# EAGLE design UI_measurement (EAGLE 9.4.0)
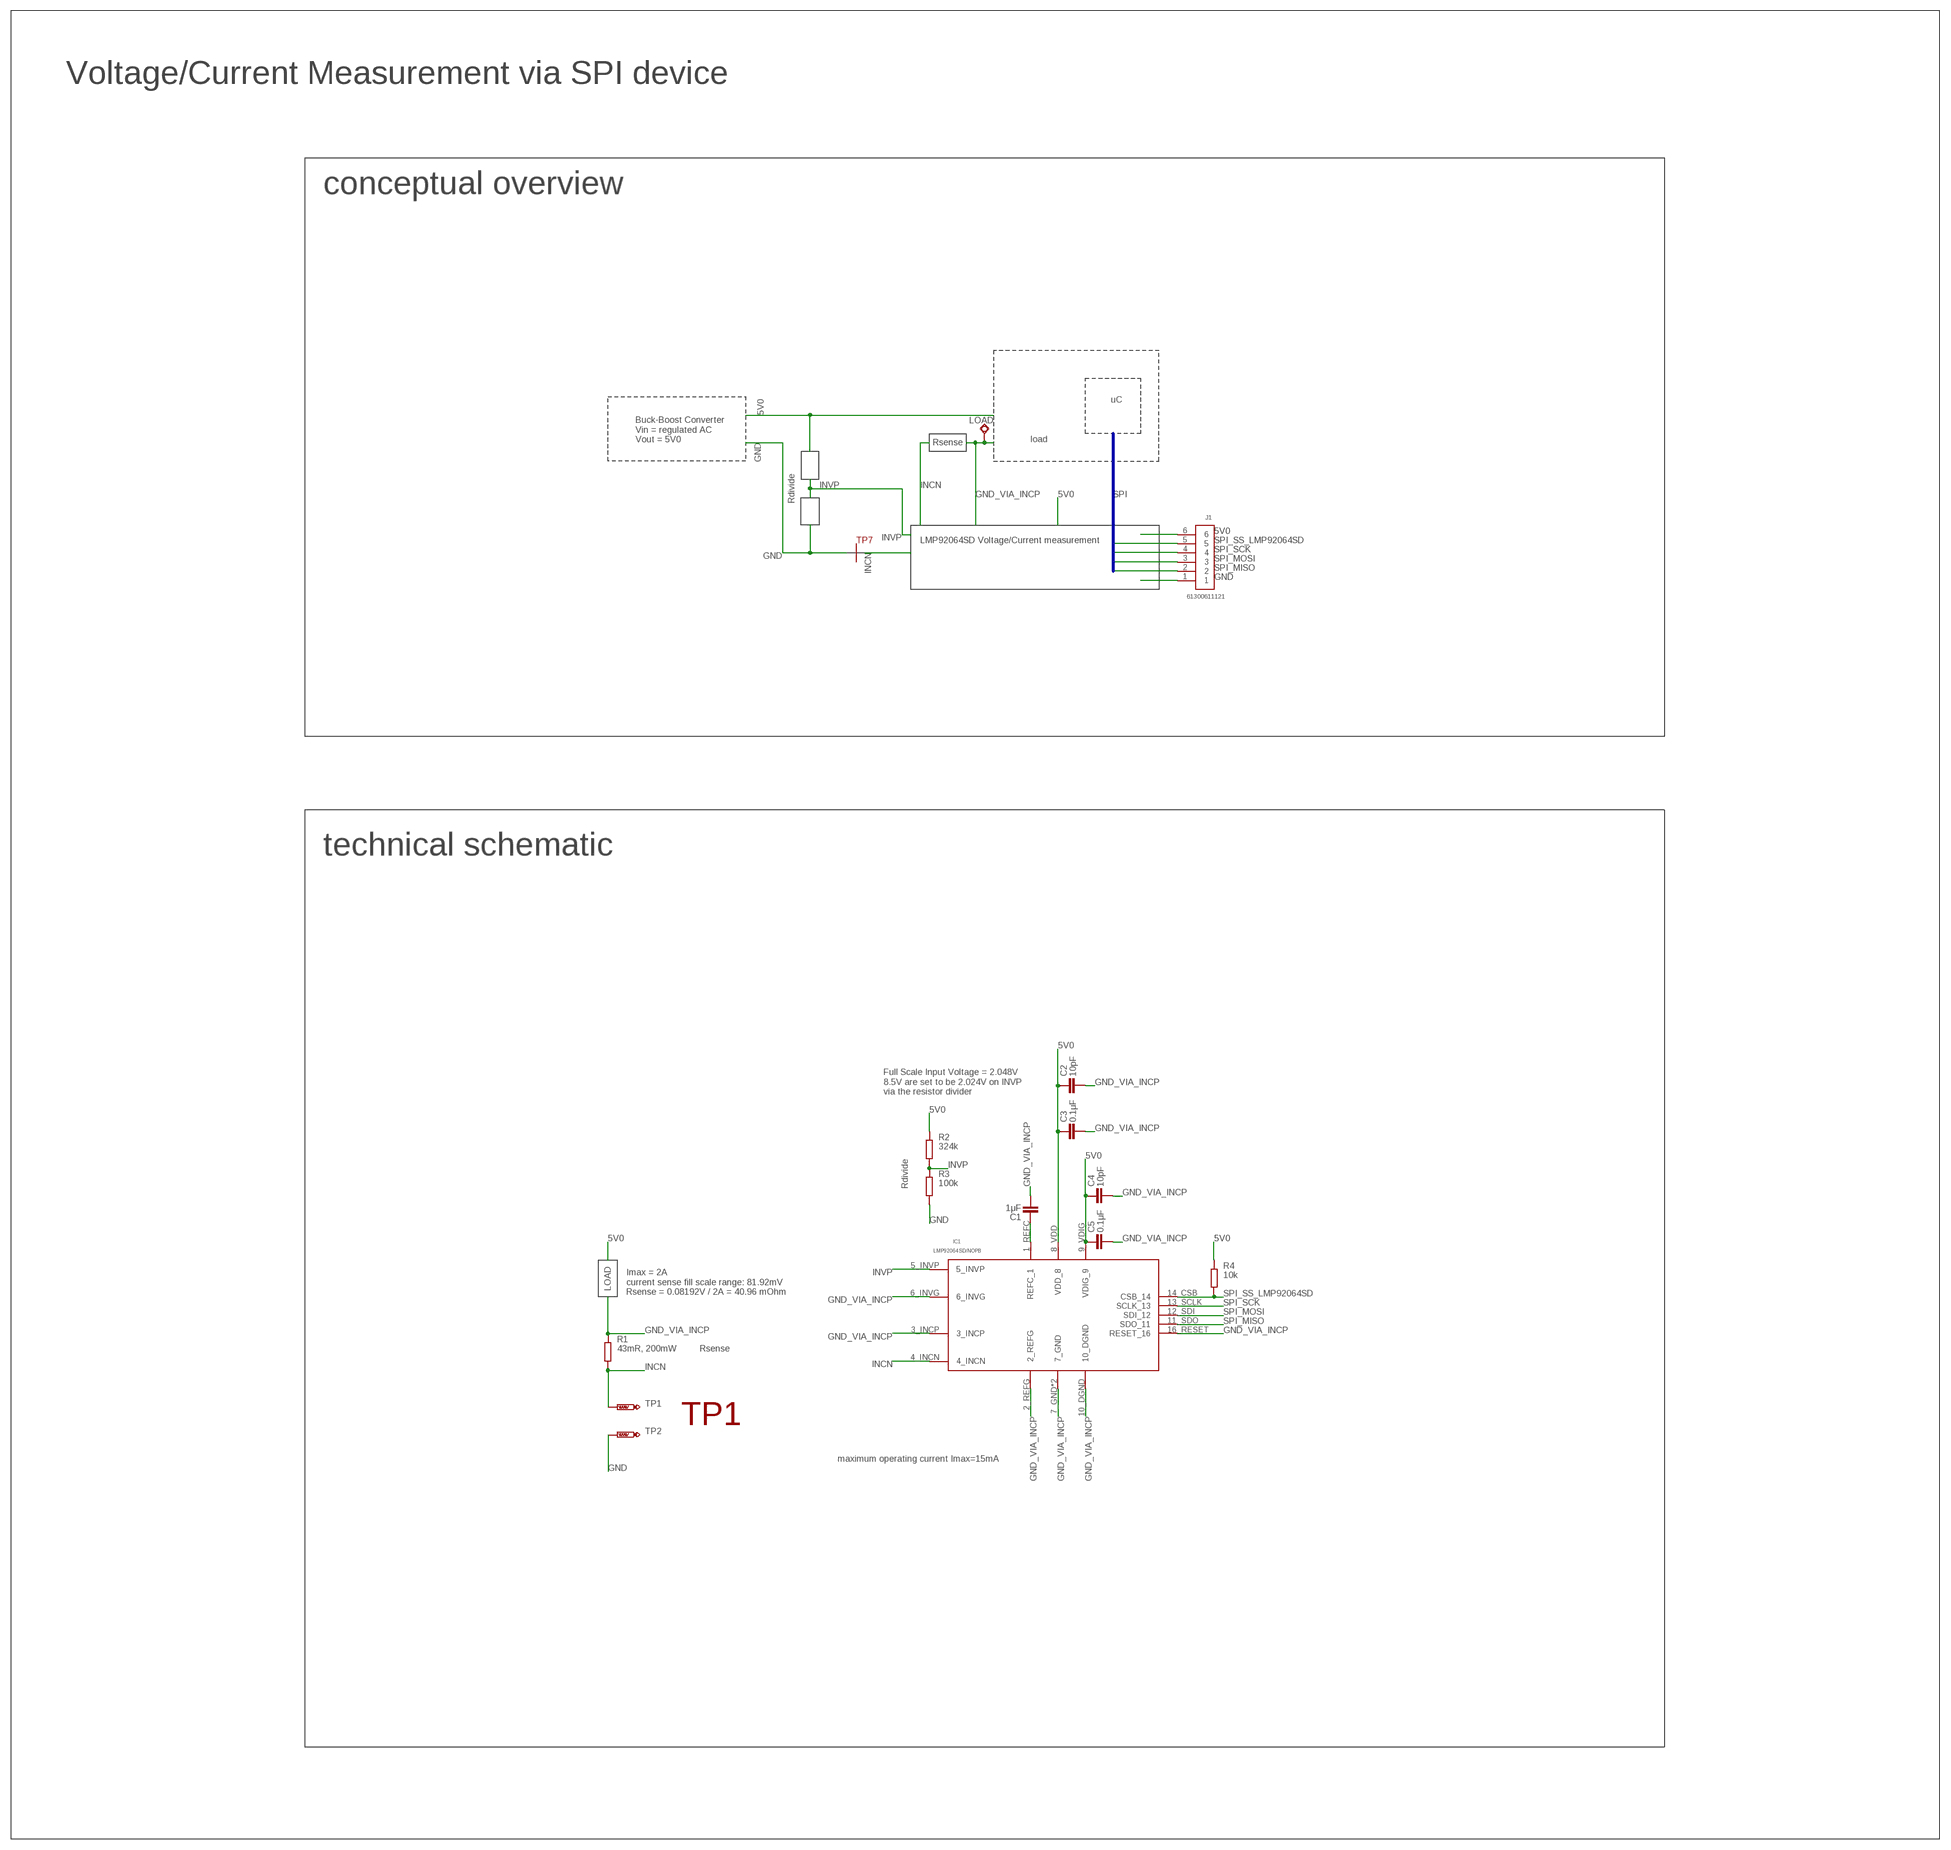
[diagram p0: schematic, sheet 1]

## Parts
C1  1μF  C-EUC0402  [C0402]
C2  10pF  C-EUC0402  [C0402]
C3  0.1μF  C-EUC0402  [C0402]
C4  10pF  C-EUC0402  [C0402]
C5  0.1μF  C-EUC0402  [C0402]
IC1  LMP92064SD/NOPB  LMP92064SD  [WSON-16]
J1  61300611121  [61300611121]
LOAD  TPSQPAD1-13  [P1-13]
R1  43mR, 200mW  R-EU_R2512  [R2512]
R2  324k  R-EU_R0402  [R0402]
R3  100k  R-EU_R0402  [R0402]
R4  10k  R-EU_R0402  [R0402]
TP1  PTR1TP10SQ  [TP10SQ]
TP2  PTR1TP10SQ  [TP10SQ]

## Nets
5V0 [5V0]: C2.1 C3.1 C4.1 C5.1 IC1.8_VDD(VDD_8) IC1.9_VDIG(VDIG_9) J1.6 R2.2 R4.2
GND: J1.1 R3.1 TP2.TP
GND_VIA_INCP [GND_VIA_INCP]: C1.2 C2.2 C3.2 C4.2 C5.2 IC1.2_REFG IC1.3_INCP IC1.6_INVG IC1.7_GND IC1.10_DGND IC1.16_RESET(RESET_16) IC1.GND1(7_GND) LOAD.TP R1.2
INCN [GND_VIA_INCP]: IC1.4_INCN R1.1 TP1.TP
INVP [signal]: IC1.5_INVP R2.1 R3.2
N$17 [signal]: C1.1 IC1.1_REFC(REFC_1)
SPI_MISO [signal]: IC1.11_SDO(SDO_11) J1.2
SPI_MOSI [signal]: IC1.12_SDI(SDI_12) J1.3
SPI_SCK [signal]: IC1.13_SCLK(SCLK_13) J1.4
SPI_SS_LMP92064SD [signal]: IC1.14_CSB(CSB_14) J1.5 R4.1

## Buses
SPI_MISO,SPI_MOSI,SPI_SCK,SPI_SS_LMP92064SD

## Notes on the sheet
- Voltage/Current Measurement via SPI device
- conceptual overview
- uC
- Buck-Boost Converter
  Vin = regulated AC
  Vout = 5V0
- Rsense | load
- Rdivide
- SPI
- TP7 | LMP92064SD Voltage/Current measurement
- technical schematic
- Full Scale Input Voltage = 2.048V
  8.5V are set to be 2.024V on INVP
  via the resistor divider
- Rdivide
- Imax = 2A
  current sense fill scale range: 81.92mV
  Rsense = 0.08192V / 2A = 40.96 mOhm
- LOAD
- Rsense
- TP1
- maximum operating current Imax=15mA

## Library data of the parts
C1-C5 = rcl:C-EU: CAPACITOR, European symbol; SPICEPREFIX: C
IC1 = LMP92064SD - LMP92064 Precision Low-Side, 125-kSps Simultaneous Sampling Current Sensor and Voltage Monitor With SPI:LMP92064SD
J1 = Headers:61300611121: CONN HEADER VERT 6POS 2.54MM Manufacturer's datasheet <https://katalog.we-online.de/em/datasheet/6130xx11121.pdf>; CREATED_BY: PCBLayout.com; DIGI_KEY_PART_NUMBER: 732-5319-ND; MANUFACTURER: Wurth Electronics Inc.; MPN: 61300611121
LOAD = testpad:TPSQ: Test pad
R1-R4 = rcl:R-EU_: RESISTOR, European symbol; SPICEPREFIX: R
TP1 TP2 = testpad:PTR1: TEST PIN

## Net classes
0 GND: width 0.5 mm, drill 0.3 mm, clearance 0.2 mm
1 GND_VIA_INCP: width 0.5 mm, drill 0.3 mm, clearance 0.2 mm
2 5V0: width 0.3 mm, drill 0.3 mm, clearance 0.2 mm
3 signal: width 0.25 mm, drill 0.3 mm, clearance 0.2 mm

## Board
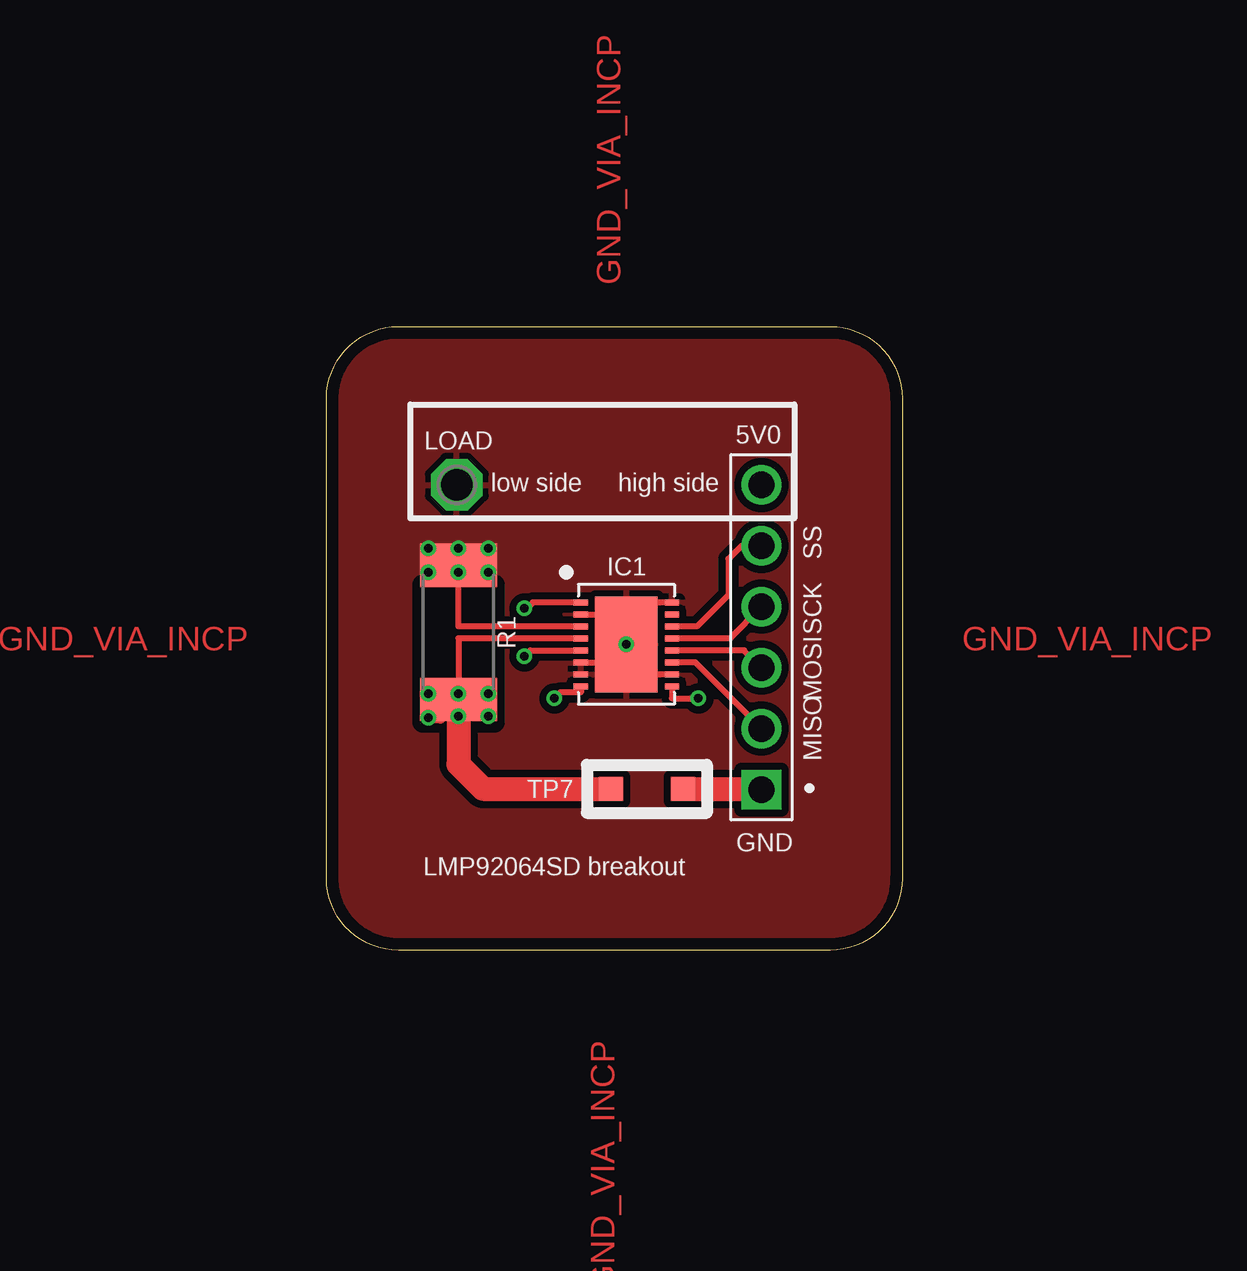
[diagram p1: board, top side]
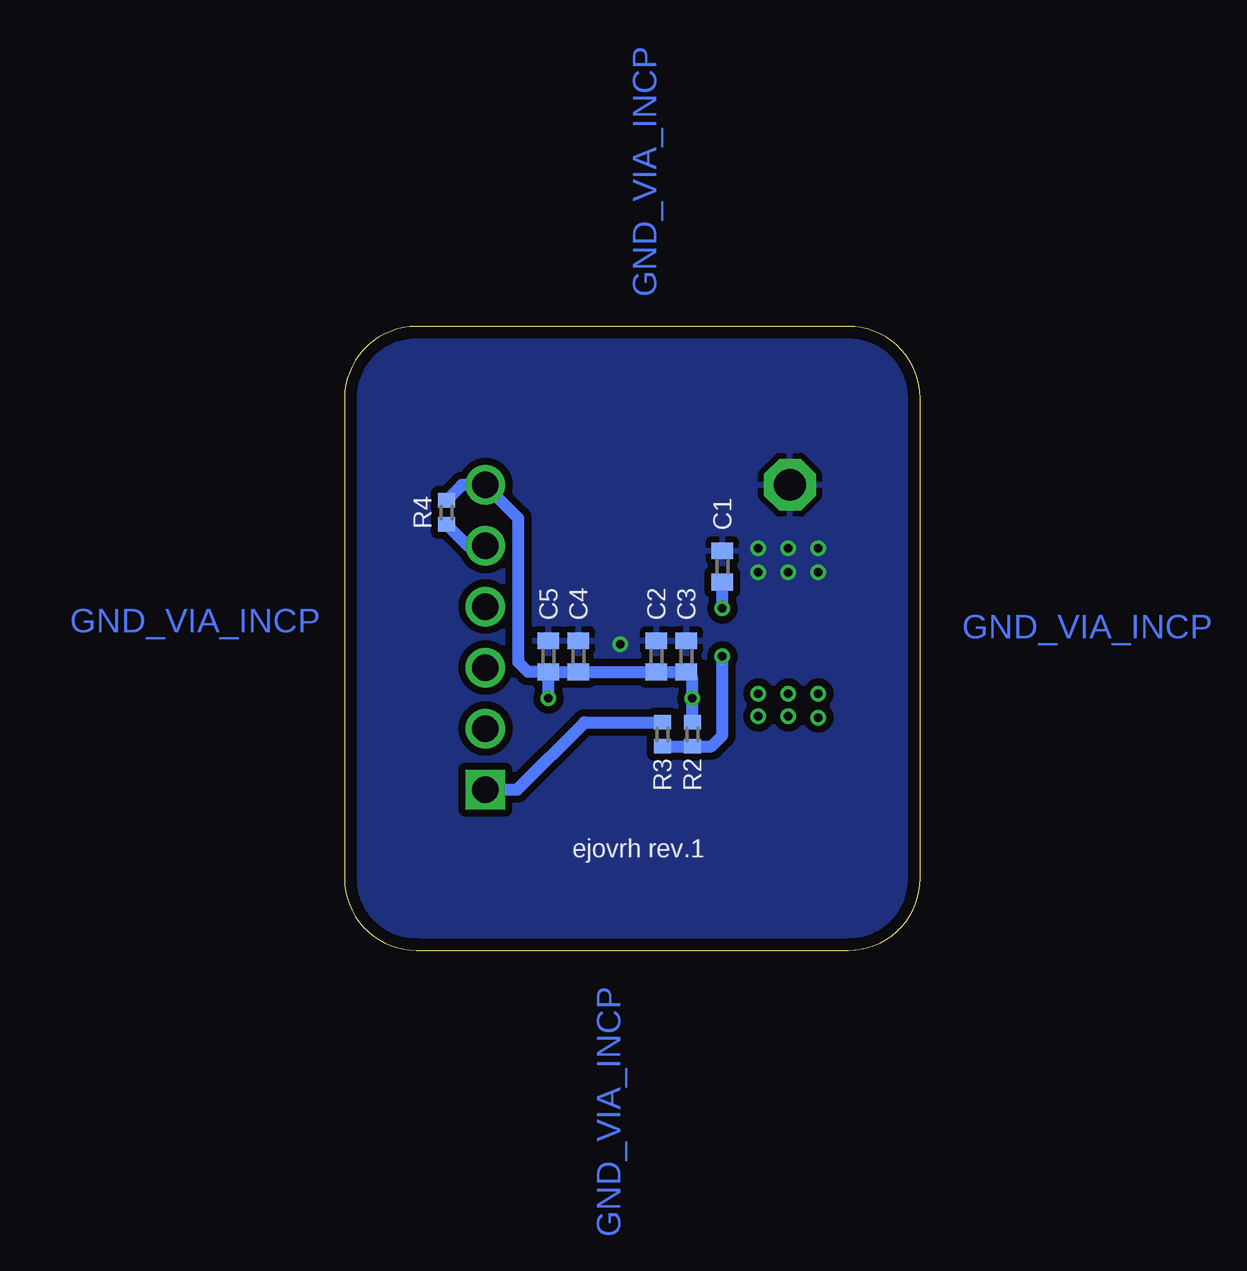
[diagram p2: board, bottom side, seen from below]

Size 24 x 26 mm. Coordinates in mm from the lower left corner, seen from the top.
Outline: 21,0 3,0 arc-90 0,3 0,23 arc-90 3,26 21,26 arc-90 24,23 24,3 arc-90 21,0
Copper layers (1*16): Top 0.035mm / dielectric 1.5mm / Bottom 0.035mm
Design rules "markovac_2layer": minimum track width 0.2mm, minimum drill 0.35mm, track to track 0.2mm, track to pad 0.2mm, pad to pad 0.2mm, via to via 0.2mm, smd to smd 0.2mm, copper to edge 0.5mm, drill to drill 8mil, minimum pad ring 0.15mm, minimum via ring 0.15mm, stop-mask expansion 4mil, vias tented up to drill 0.34mm, thermal gap 10mil
tRestrict: area 4,9.5 to 11,15.2

### Footprints (pad centres in the part's own frame; a part is rotated, then mirrored left to right if it is on the bottom)
C0402 = smd 0.7 x 0.9: 1 -0.65,0; 2 0.65,0
WSON-16 = smd 0.25 x 0.6: 1_REFC -1.75,-1.9; 2_REFG -1.25,-1.9; 3_INCP -0.75,-1.9; 4_INCN -0.25,-1.9; 5_INVP 0.25,-1.9; 6_INVG 0.75,-1.9; 7_GND 1.25,-1.9; 8_VDD 1.75,-1.9; 9_VDIG 1.75,1.9; 10_DGND 1.25,1.9; 11_SDO 0.75,1.9; 12_SDI 0.25,1.9; 13_SCLK -0.25,1.9; 14_CSB -0.75,1.9; 15_RESERVED -1.25,1.9; 16_RESET -1.75,1.9 | smd 4 x 2.6: GND1 0,0
61300611121 = drill 1.1 square: 1 -6.35,0 | drill 1.1: 2 -3.81,0; 3 -1.27,0; 4 1.27,0; 5 3.81,0; 6 6.35,0
P1-13 = drill 1.321 pad 2.159 octagon: TP 0,0
R2512 = smd 1.8 x 3.2: 1 -2.8,0; 2 2.8,0
R0402 = smd 0.6 x 0.7: 1 -0.5,0; 2 0.5,0
TP10SQ = smd 1 x 1: TP 0,0

### Placement (x,y rotation side)
C1  8.25,16 90 bottom
C2  11,12.25 90 bottom
C3  9.75,12.25 90 bottom
C4  14.25,12.25 90 bottom
C5  15.5,12.25 90 bottom
IC1  12.5,12.75 270 top
J1  18.13,13.05 90 top
LOAD  5.43,19.4 0 top
R1  5.5,13.25 90 top
R2  9.5,9 90 bottom
R3  10.75,9 270 bottom
R4  19.75,18.25 90 bottom
TP1  11.85,6.73 270 top
TP2  14.85,6.73 270 top

### Tracks (layer width: path | path; a pad name or v marks a point on that pad's centre or on a via)
5V0  (via drill 0.35)
  Top 0.25: IC1.9_VDIG 14.4,10.5 v15.5,10.5 | IC1.8_VDD 10.6,10.75 9.75,10.75 v9.5,10.5
  Bottom 0.5: R4.2 19.1,19.4 18.15,19.4 | J1.6 18.15,19.4 | v15.5,10.5 C5.1 | C5.1 C4.1 C2.1 C3.1 9.5,11.35 v9.5,10.5 R2.2 | C5.1 16.35,11.6 16.75,12 16.75,18 18.15,19.4
GND
  Top 0.5: 18.1,6.73 J1.1
  Top 1: TP2.TP 18.1,6.73
  Bottom 0.5: J1.1 16.8,6.7 14,9.5 R3.1
GND_VIA_INCP  (via drill 0.35)
  Top 0.25: IC1.10_DGND 12.5,11.5 | IC1.6_INVG 11.5,12 | IC1.3_INCP 5.5,13.5 v5.5,15.75 v5.5,16.75
  Top 0.254: IC1.16_RESET 12.5,14.5 12.5,14 | IC1.2_REFG 12.5,14 | 12.5,14 12.5,13 IC1.GND1
  Top 0.5: 11.5,12 12.5,13
  other vias: 12.5,12.75 6.75,15.75 6.75,16.75 4.25,15.75 4.25,16.75
  pour Top (isolate 0.3): 0,26 24,26 24,0 0,0
  pour Bottom (isolate 0.3): 0,26 24,26 24,0 0,0
  pour Top (isolate 0.3, no thermals): 3.25,17.5 7.75,17.5 7.75,14.75 3.25,14.75
INCN  (via drill 0.35)
  Top 0.25: IC1.4_INCN 5.5,13 5.5,10.75 5.5,10.5 4.25,10.5
  Top 0.5: 6.75,10.5 5.5,10.5 v5.5,10.7 | v5.5,10.7 v6.75,10.7 v6.75,9.75 | v5.5,10.7 v4.25,10.7 4.25,10 | v5.5,10.7 v5.5,9.75 | 5.5,10.75 R1.1 4.75,9.7 v4.25,9.7
  Top 1: R1.1 5.5,7.75 6.52,6.73 TP1.TP
INVP  (via drill 0.35)
  Top 0.25: v8.25,12.25 8.5,12.5 IC1.5_INVP
  Bottom 0.5: R3.2 R2.1 8.71,8.5 8.25,8.96 v8.25,12.25
N$17  (via drill 0.35)
  Top 0.25: IC1.1_REFC 8.6,14.5 8.35,14.25 v8.25,14.25
  Bottom 0.5: v8.25,14.25 C1.1
SPI_MISO
  Top 0.25: J1.2 15.37,12 IC1.11_SDO
SPI_MOSI
  Top 0.25: J1.3 17.41,12.5 IC1.12_SDI
SPI_SCK
  Top 0.25: J1.4 16.81,13 IC1.13_SCLK
SPI_SS_LMP92064SD
  Top 0.25: J1.5 17.3,16.86 16.75,16.31 16.75,14.81 15.44,13.5 IC1.14_CSB
  Bottom 0.5: J1.5 18.86,16.86 R4.1

### Text on the board
Top: GND_VIA_INCP | GND_VIA_INCP | GND_VIA_INCP | GND_VIA_INCP
Bottom: GND_VIA_INCP | GND_VIA_INCP | GND_VIA_INCP | GND_VIA_INCP
tPlace: 5V0 | low side | high side | SS | SCK | MOSI | MISO | TP7 | LMP92064SD breakout | GND
bPlace: ejovrh rev.1